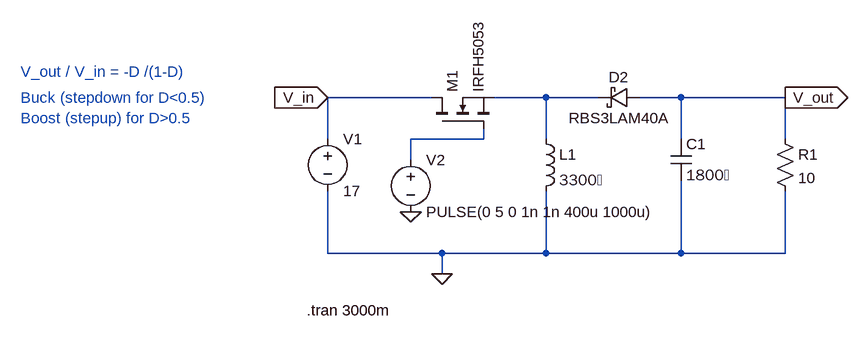
[diagram p0: schematic BuckBoostDCDC.asc]
BuckBoostDCDC.asc, the LTspice schematic file:
Version 4
SHEET 1 880 680
WIRE -64 64 -224 64
WIRE 112 64 32 64
WIRE 192 64 112 64
WIRE 320 64 256 64
WIRE 480 64 320 64
WIRE -224 128 -224 64
WIRE 16 128 16 112
WIRE 16 128 -96 128
WIRE 112 128 112 64
WIRE 320 128 320 64
WIRE 480 128 480 64
WIRE -96 160 -96 128
WIRE -224 304 -224 208
WIRE -48 304 -224 304
WIRE 112 304 112 208
WIRE 112 304 -48 304
WIRE 320 304 320 192
WIRE 320 304 112 304
WIRE 480 304 480 208
WIRE 480 304 320 304
WIRE -48 336 -48 304
FLAG -48 336 0
FLAG -224 64 V_in
IOPIN -224 64 In
FLAG 480 64 V_out
IOPIN 480 64 Out
FLAG -96 240 0
SYMBOL ind 96 112 R0
SYMATTR InstName L1
SYMATTR Value 3300�
SYMBOL cap 304 128 R0
SYMATTR InstName C1
SYMATTR Value 1800�
SYMBOL res 464 112 R0
SYMATTR InstName R1
SYMATTR Value 10
SYMBOL nmos -64 112 R270
SYMATTR InstName M1
SYMATTR Value IRFH5053
SYMBOL voltage -224 112 R0
WINDOW 123 0 0 Left 0
WINDOW 39 0 0 Left 0
SYMATTR InstName V1
SYMATTR Value 17
SYMBOL voltage -96 144 R0
WINDOW 123 0 0 Left 0
WINDOW 39 0 0 Left 0
SYMATTR InstName V2
SYMATTR Value PULSE(0 5 0 1n 1n 400u 1000u)
SYMBOL schottky 256 48 R90
WINDOW 0 0 32 VBottom 2
WINDOW 3 32 32 VTop 2
SYMATTR InstName D2
SYMATTR Value RBS3LAM40A
TEXT -696 24 Left 2 ;V_out / V_in = -D /(1-D)
TEXT -696 64 Left 2 ;Buck (stepdown for D<0.5)
TEXT -696 96 Left 2 ;Boost (stepup) for D>0.5
TEXT -256 392 Left 2 !.tran 3000m

The netlist it stands for:
* BuckBoostDCDC.asc
L1 N001 0 3300�
C1 V_out 0 1800�
R1 V_out 0 10
M1 V_in N002 N001 N001 IRFH5053
V1 V_in 0 17
V2 N002 0 PULSE(0 5 0 1n 1n 400u 1000u)
D2 V_out N001 RBS3LAM40A
.model D D
.lib standard.dio
.model NMOS NMOS
.model PMOS PMOS
.lib standard.mos
* V_out / V_in = -D /(1-D)
* Buck (stepdown for D<0.5)
* Boost (stepup) for D>0.5
.tran 3000m
.backanno
.end